# Altium schematic sheet p3_keypad_encoder_led.SchDoc
size A2; Organization: Protel International P/L; Address1: L3, 12a Rodborough Rd; Address2: Frenchs Forest; Address3: NSW; Address4: Australia 2086
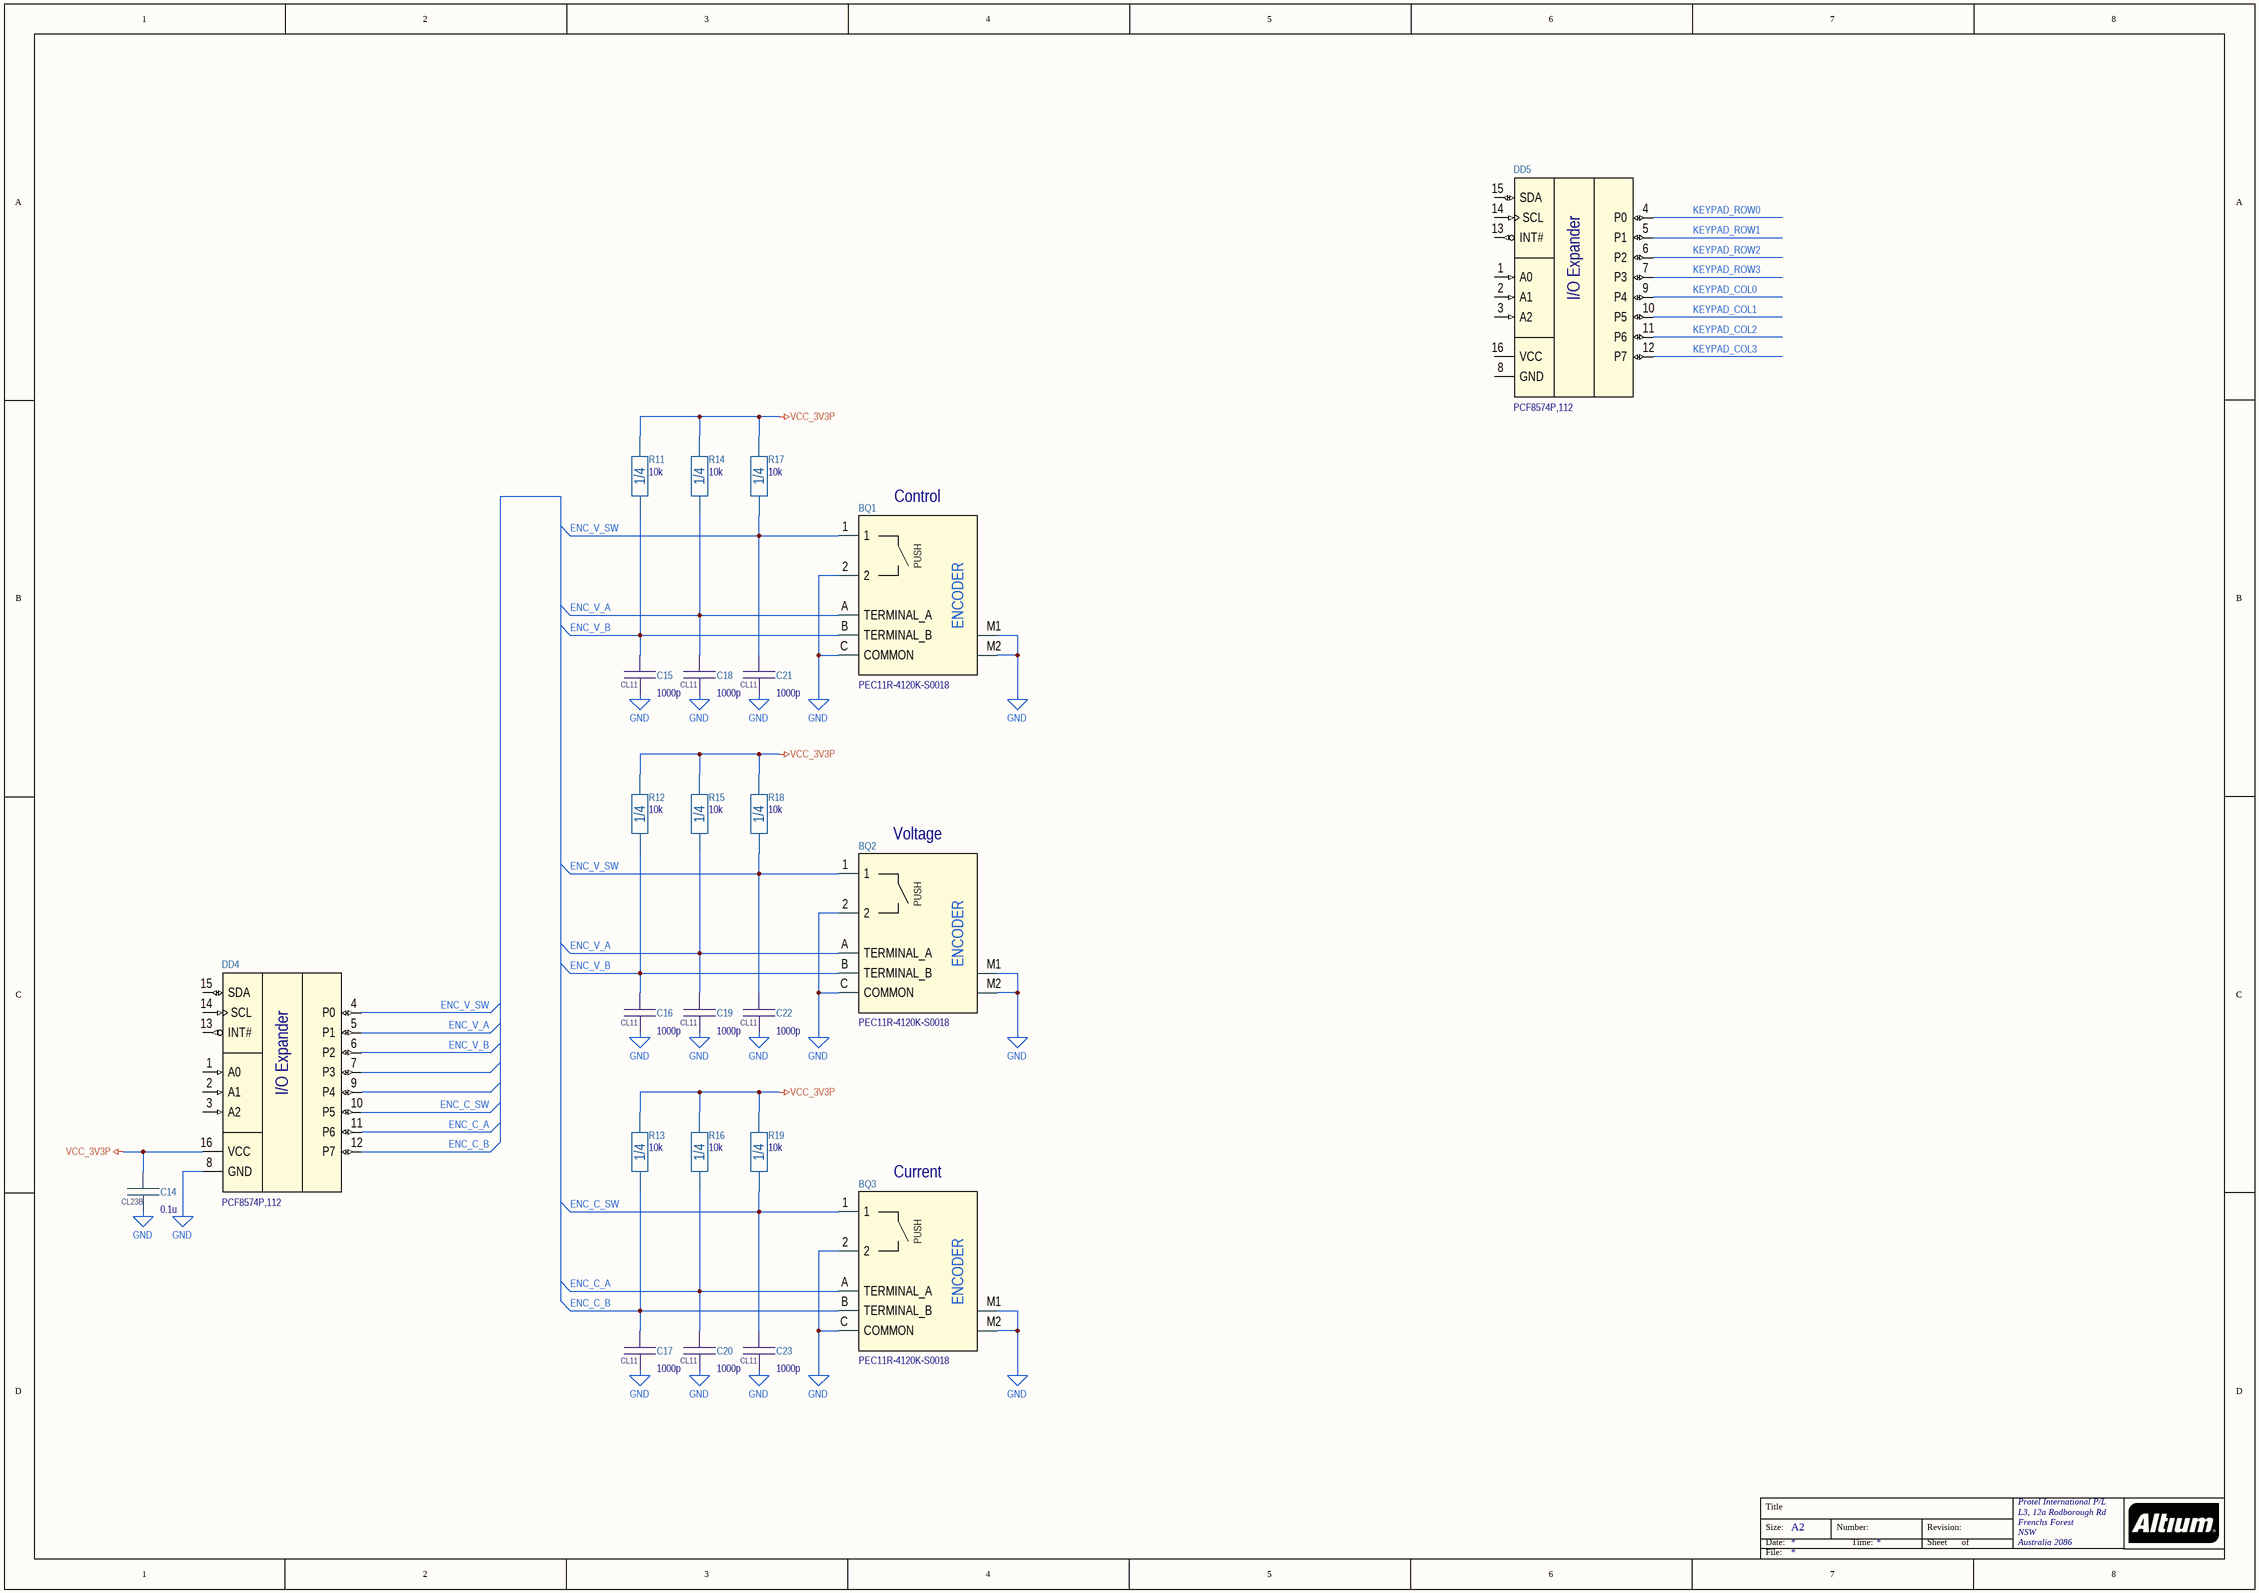
[diagram p0: p3_keypad_encoder_led.SchDoc]

## Parts
BQ1  PEC11R-4120K-S0018  [PEC11R-4120K-S0018]
BQ2  PEC11R-4120K-S0018  [PEC11R-4120K-S0018]
BQ3  PEC11R-4120K-S0018  [PEC11R-4120K-S0018]
C14  0.1u  [CL23B_7.2x2.5]
C15  1000p  [CL11_6x3.5_P3.5]
C16  1000p  [CL11_6x3.5_P3.5]
C17  1000p  [CL11_6x3.5_P3.5]
C18  1000p  [CL11_6x3.5_P3.5]
C19  1000p  [CL11_6x3.5_P3.5]
C20  1000p  [CL11_6x3.5_P3.5]
C21  1000p  [CL11_6x3.5_P3.5]
C22  1000p  [CL11_6x3.5_P3.5]
C23  1000p  [CL11_6x3.5_P3.5]
DD4  PCF8574P,112  [DIP-16P-M03]
DD5  PCF8574P,112  [DIP-16P-M03]
R11  10k  Package: 1/4  [CFR-25]
R12  10k  Package: 1/4  [CFR-25]
R13  10k  Package: 1/4  [CFR-25]
R14  10k  Package: 1/4  [CFR-25]
R15  10k  Package: 1/4  [CFR-25]
R16  10k  Package: 1/4  [CFR-25]
R17  10k  Package: 1/4  [CFR-25]
R18  10k  Package: 1/4  [CFR-25]
R19  10k  Package: 1/4  [CFR-25]

## Nets
GND: BQ1.2 BQ1.C(COMMON) BQ1.M1(MECHANICAL1) BQ1.M2(MECHANICAL2) BQ2.2 BQ2.C(COMMON) BQ2.M1(MECHANICAL1) BQ2.M2(MECHANICAL2) BQ3.2 BQ3.C(COMMON) BQ3.M1(MECHANICAL1) BQ3.M2(MECHANICAL2) C14.2 C15.1 C16.1 C17.1 C18.1 C19.1 C20.1 C21.1 C22.1 C23.1 DD4.8(GND)
VCC_3V3P: C14.1 DD4.16(VCC) R11.2 R12.2 R13.2 R14.2 R15.2 R16.2 R17.2 R18.2 R19.2
ENC_C_A: BQ3.A(TERMINAL_A) C20.2 DD4.11(P6) R16.1
ENC_C_B: BQ3.B(TERMINAL_B) C17.2 DD4.12(P7) R13.1
ENC_C_SW: BQ3.1 C23.2 DD4.10(P5) R19.1
ENC_V_A: BQ1.A(TERMINAL_A) BQ2.A(TERMINAL_A) C18.2 C19.2 DD4.5(P1) R14.1 R15.1
ENC_V_B: BQ1.B(TERMINAL_B) BQ2.B(TERMINAL_B) C15.2 C16.2 DD4.6(P2) R11.1 R12.1
ENC_V_SW: BQ1.1 BQ2.1 C21.2 C22.2 DD4.4(P0) R17.1 R18.1
KEYPAD_COL0: DD5.9(P4)
KEYPAD_COL1: DD5.10(P5)
KEYPAD_COL2: DD5.11(P6)
KEYPAD_COL3: DD5.12(P7)
KEYPAD_ROW0: DD5.4(P0)
KEYPAD_ROW1: DD5.5(P1)
KEYPAD_ROW2: DD5.6(P2)
KEYPAD_ROW3: DD5.7(P3)

Not connected (* = marked no-connect by the designer): DD4 1(A0) 2(A1) 3(A2) 7(P3) 9(P4) 13(INT#) 14(SCL) 15(SDA); DD5 1(A0) 2(A1) 3(A2) 8(GND) 13(INT#) 14(SCL) 15(SDA) 16(VCC)

## Notes on the sheet
- (near BQ1) Control
- (near BQ2) Voltage
- (near BQ3) Current
- Title
- Size:
- Date:
- File:
- A2
- Number:
- Time:
- Revision:
- Sheet
- of
- (in symbol PCF8574P,112) I/O Expander
- (in symbol PEC11R-4120K-S0018) PUSH; ENCODER

## Library data of the parts
BQ1-BQ3 = PEC11R-4120K-S0018: 12 mm Incremental Encoder; Manufacturer: Bourns Inc.; Part Number: PEC11R-4120K-S0018
C14 = CL23B: Box-type metallized polyester film capacitor; Tolerance: ± * %; Voltage: 63V; Value: 0.1u; Dielectric: Polyester; Value on schem: 0.1u; Part Number: *; Manufacturer: *; Package: CL23B
C15-C23 = CL11: CL11 Type Polyester Film Metal Foil Capacitor-inductive; Tolerance: ± 5 %; Voltage: 100V; Value: 1000p; Dielectric: Polyester; Value on schem: 1000p; Part Number: *; Manufacturer: *; Package: CL11
DD4 DD5 = PCF8574P,112: Remote 8-bit I/O expander for I2C-bus; Manufacturer: NXP USA Inc.; Package: DIP-16; Part Number: PCF8574P,112
R11-R19 = CF25: Resistor 1/4W; Part Number: MFR-25FTF52-10K; Manufacturer: Yageo; Tolerance: ± 1 %; Voltage: 250V; Temperature Coefficient: ±100 ppm/°C; Value: 10k; Value on schem: 10k